# EAGLE design epoch-rev-a (EAGLE 9.7.0)
DOCUMENT_NUMBER: Epoch - 16-ch Vibe Controller; REV: A
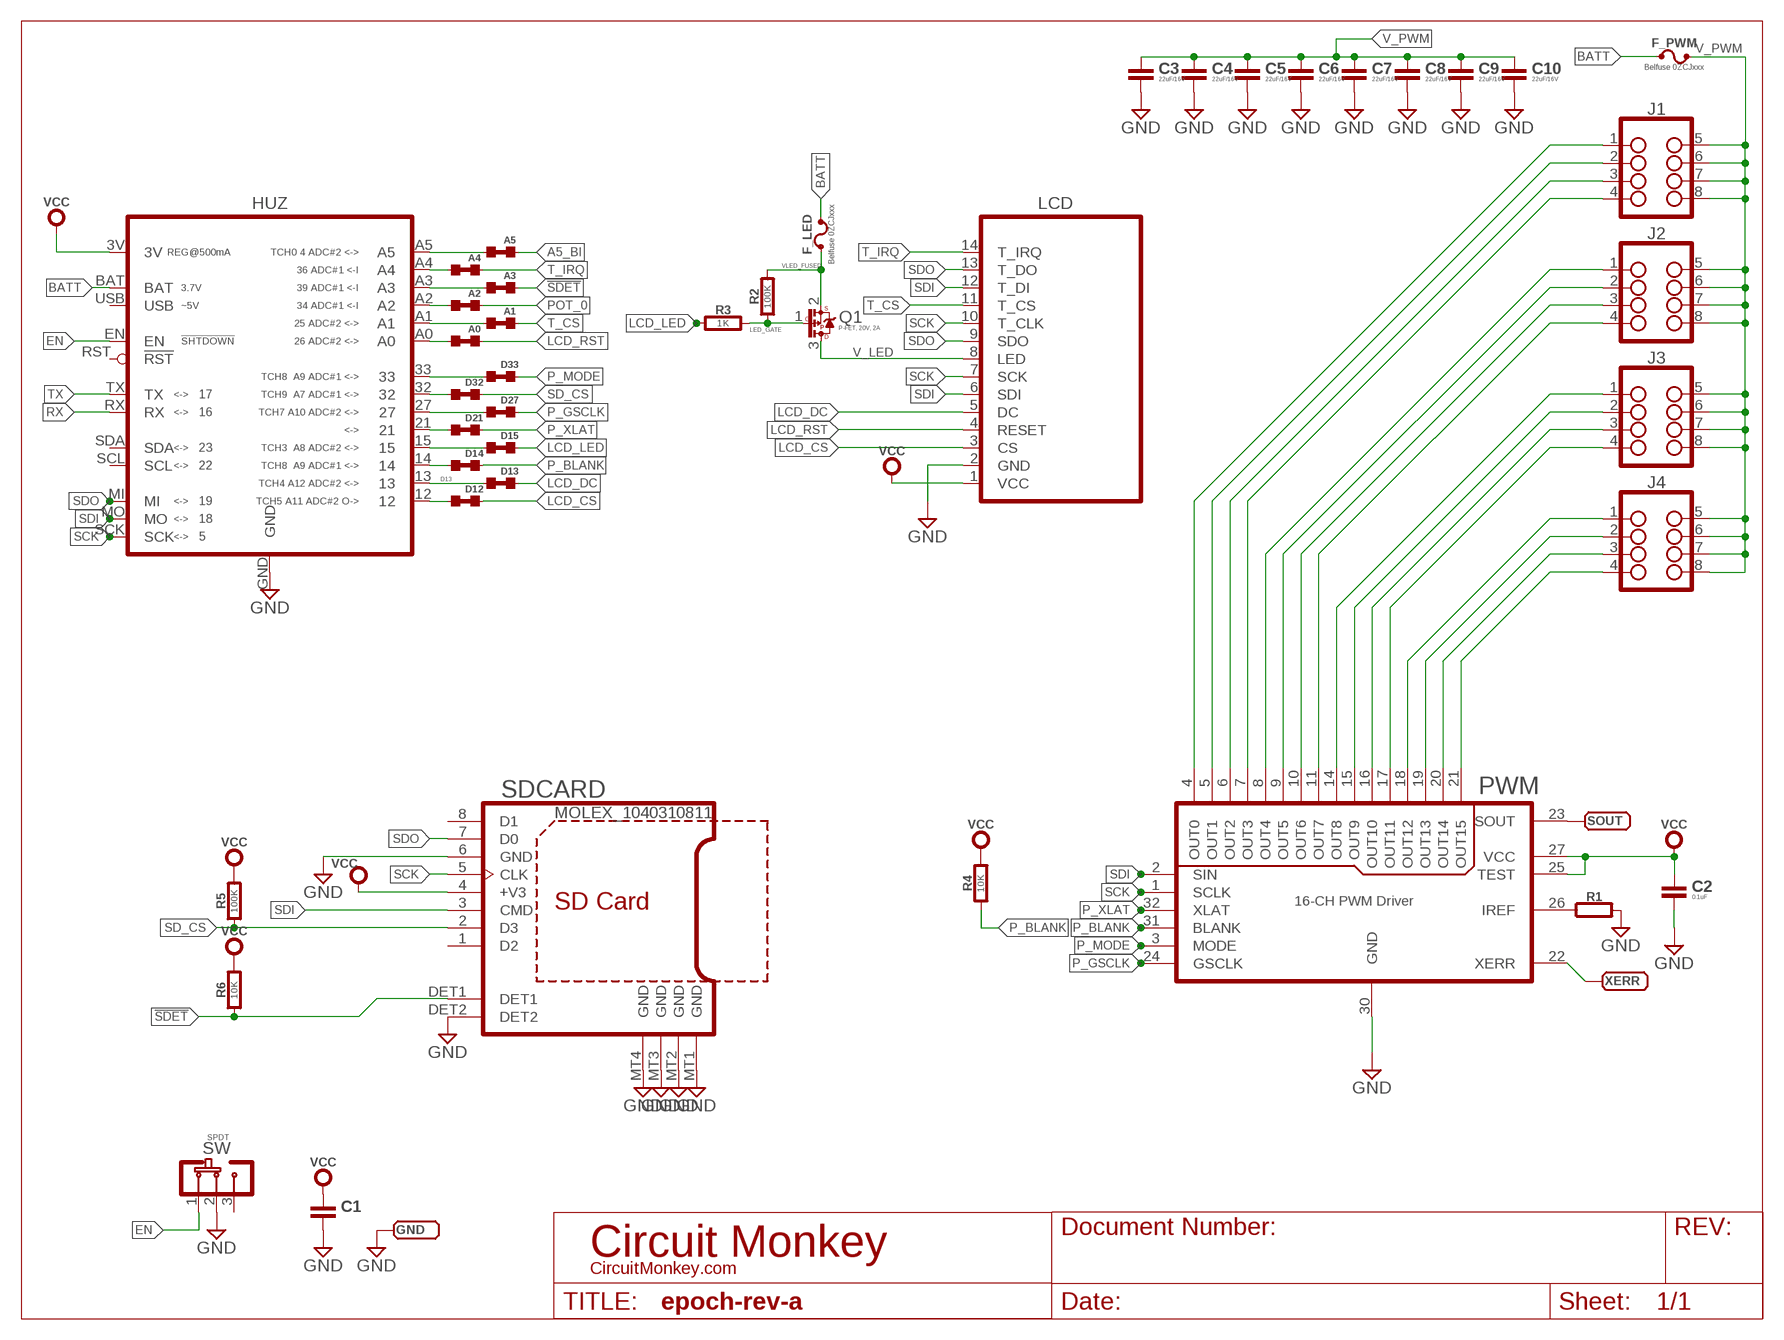
[diagram p0: schematic, sheet 1]

## Parts
A0  NP  SHORT0603  [0603-SHORT]
A1  NP  SHORT0603  [0603-SHORT]
A2  NP  SHORT0603  [0603-SHORT]
A3  NP  SHORT0603  [0603-SHORT]
A4  NP  SHORT0603  [0603-SHORT]
A5  NP  SHORT0603  [0603-SHORT]
C1  CAPACITOR0603  [0603-CAP]
C2  0.1uF  CAPACITOR0603  [0603-CAP]
C3  22uF/16V  CAPACITOR1210  [1210-CAP]
C4  22uF/16V  CAPACITOR1210  [1210-CAP]
C5  22uF/16V  CAPACITOR1210  [1210-CAP]
C6  22uF/16V  CAPACITOR1210  [1210-CAP]
C7  22uF/16V  CAPACITOR1210  [1210-CAP]
C8  22uF/16V  CAPACITOR1210  [1210-CAP]
C9  22uF/16V  CAPACITOR1210  [1210-CAP]
C10  22uF/16V  CAPACITOR1210  [1210-CAP]
D12  NP  SHORT0603  [0603-SHORT]
D13  NP  SHORT0603  [0603-SHORT]
D14  NP  SHORT0603  [0603-SHORT]
D15  NP  SHORT0603  [0603-SHORT]
D21  NP  SHORT0603  [0603-SHORT]
D27  NP  SHORT0603  [0603-SHORT]
D32  NP  SHORT0603  [0603-SHORT]
D33  NP  SHORT0603  [0603-SHORT]
F_LED  Belfuse 0ZCJxxx  FUSEPOLY-1206  [BELFUSE-1206]
F_PWM  Belfuse 0ZCJxxx  FUSEPOLY-1206  [BELFUSE-1206]
GND  PADSMD-050X050  [SMD-050X050]
HUZ  HUZZAHHUZZAH  [ADAFRUIT_HUZZAH32]
J1  NANOFIT-08P-DR-RA-THD  [MOLEX-105314-XX08]
J2  NANOFIT-08P-DR-RA-THD  [MOLEX-105314-XX08]
J3  NANOFIT-08P-DR-RA-THD  [MOLEX-105314-XX08]
J4  NANOFIT-08P-DR-RA-THD  [MOLEX-105314-XX08]
LCD  LCD-320X240-3.2-INCH-SPI-DIANN-LOWPROFILE  [LCD-320X240-DIANN-3.2-LP-SOCKET]
PWM  16-CH PWM Driver  TLC59401-QFN  [QFN-32]
Q1  P-FET, 20V, 2A  P-FETSOT-23-2A  [SOT-23]
R1  RESISTOR0603  [0603-RES]
R2  100K  RESISTOR0603  [0603-RES]
R3  1K  RESISTOR0603  [0603-RES]
R4  10K  RESISTOR0603  [0603-RES]
R5  100K  RESISTOR0603  [0603-RES]
R6  10K  RESISTOR0603  [0603-RES]
SDCARD  MOLEX_1040310811  MICRO-SD-CARDMOLEX-1040310811  [MOLEX_1040310811_USD]
SOUT  PADSMD-050X050  [SMD-050X050]
SW  SPDT  SLIDE-SPDTCK_TS01  [CK_TS01C]
XERR  PADSMD-050X050  [SMD-050X050]

## Nets
!SDET: A3.4 R6.1 SDCARD.DET1
A5_BI: A5.4
BATT: F_LED.2 F_PWM.1 HUZ.BAT
D12: D12.3 HUZ.12
D13: D13.3 HUZ.13
D14: D14.3 HUZ.14
D15: D15.3 HUZ.15
EN: HUZ.EN SW.1(A)
GND: C1.2 C2.2 C3.2 C4.2 C5.2 C6.2 C7.2 C8.2 C9.2 C10.2 GND.1(PAD) HUZ.GND LCD.2(GND) PWM.30(GND) R1.2 SDCARD.6(GND) SDCARD.DET2 SDCARD.MT1(GND) SDCARD.MT2(GND) SDCARD.MT3(GND) SDCARD.MT4(GND) SW.2(C)
LCD_CS: D12.4 LCD.3(CS)
LCD_DC: D13.4 LCD.5(DC)
LCD_LED: D15.4 R3.1
LCD_RST: A0.4 LCD.4(RESET)
LED_GATE: Q1.1(G) R2.1 R3.2
N$2: J4.4 PWM.21(OUT15)
N$3: J4.3 PWM.20(OUT14)
N$4: J4.2 PWM.19(OUT13)
N$5: J4.1 PWM.18(OUT12)
N$6: J3.4 PWM.17(OUT11)
N$7: J3.3 PWM.16(OUT10)
N$8: J3.2 PWM.15(OUT9)
N$9: J3.1 PWM.14(OUT8)
N$10: J2.4 PWM.11(OUT7)
N$11: J2.3 PWM.10(OUT6)
N$12: J2.2 PWM.9(OUT5)
N$13: J2.1 PWM.8(OUT4)
N$14: J1.4 PWM.7(OUT3)
N$15: J1.3 PWM.6(OUT2)
N$16: J1.2 PWM.5(OUT1)
N$17: J1.1 PWM.4(OUT0)
N$22: PWM.26(IREF) R1.1
N$23: PWM.22(XERR) XERR.1(PAD)
N$24: PWM.23(SOUT) SOUT.1(PAD)
N$27: D21.3 HUZ.21
N$28: D27.3 HUZ.27
N$29: D32.3 HUZ.32
N$30: D33.3 HUZ.33
N$31: A0.3 HUZ.A0
N$32: A1.3 HUZ.A1
N$33: A2.3 HUZ.A2
N$34: A3.3 HUZ.A3
N$35: A4.3 HUZ.A4
N$36: A5.3 HUZ.A5
P_BLANK: D14.4 PWM.31(BLANK) R4.1
P_GSCLK: D27.4 PWM.24(GSCLK)
P_MODE: D33.4 PWM.3(MODE)
P_XLAT: D21.4 PWM.32(XLAT)
POT_0: A2.4
RX: HUZ.RX
SCK: HUZ.SCK LCD.7(SCK) LCD.10(T_CLK) PWM.1(SCLK) SDCARD.5(CLK)
SD_CS: D32.4 R5.1 SDCARD.2(D3)
SDI: HUZ.MO LCD.6(SDI) LCD.12(T_DI) PWM.2(SIN) SDCARD.3(CMD)
SDO: HUZ.MI LCD.9(SDO) LCD.13(T_DO) SDCARD.7(D0)
T_CS: A1.4 LCD.11(T_CS)
T_IRQ: A4.4 LCD.14(T_IRQ)
TX: HUZ.TX
V_LED: LCD.8(LED) Q1.3(D)
V_PWM: C3.1 C4.1 C5.1 C6.1 C7.1 C8.1 C9.1 C10.1 F_PWM.2 J1.5 J1.6 J1.7 J1.8 J2.5 J2.6 J2.7 J2.8 J3.5 J3.6 J3.7 J3.8 J4.5 J4.6 J4.7 J4.8
VCC: C1.1 C2.1 HUZ.3V LCD.1(VCC) PWM.25(TEST) PWM.27(VCC) R4.2 R5.2 R6.2 SDCARD.4(+V3)
VLED_FUSED: F_LED.1 Q1.2(S) R2.2
Unconnected: HUZ.RST(!RST) HUZ.SCL HUZ.SDA HUZ.USB SDCARD.1(D2) SDCARD.8(D1) SW.3(B)

## Library data of the parts
A0 A1-A5 D12-D15 D21 D27 D32 D33 = rlc:SHORT: Pre-shorted SMT Resistor Pad
C1 C2 = rlc:CAPACITOR: Capacitor; COST01: 0.12; COST10: 0.09; COST100: 0.05
C3-C10 = rlc:CAPACITOR: Capacitor
F_LED F_PWM = fuse:FUSE: Fuse
GND SOUT XERR = con-testpoints:PAD: Solder Pad
HUZ = co-espressif:HUZZAH: AdaFruit Huzzah32
J1-J4 = con-molex:NANOFIT-08P-DR: 8-pin, Nanofit, 2-ROW, RA, SMD
LCD = display-lcd-oled:LCD-320X240-3.2-INCH-SPI
PWM = co-texas-instruments:TLC59401: 16-CHANNEL LED DRIVER WITH DOT CORRECTION AND GRAYSCALE PWM CONTROL; MFR: Texas Instruments; MOUSER: https://www.mouser.com/ProductDetail/Texas-Instruments/TLC59401RHBR?qs=sGAEpiMZZMtnFuLo2AlFPtoSfKJDVuimuLoLYJhTXxU%3D; MPN: TLC59401RHB
Q1 = transistor-fet:P-FET: P-FET (PFET); COST01: 0.45; COST10: 0.35; COST100: 0.25; MPN: FDN340P; SEEED: 305030026
R1-R6 = rlc:RESISTOR: Resistor; COST01: 0.10; COST10: 0.05; COST100: 0.02
SDCARD = con-memory-card:MICRO-SD-CARD: MICRO-SD; COST01: 2.25; COST10: 1.90; COST100: 1.60; MFR: Molex; MPN: 1040310811
SW = switch-thd:SLIDE-SPDT; COST01: 5.00; COST10: 4.00; COST100: 2.00; MFR: C&K; MPN: TS01C*

## Board
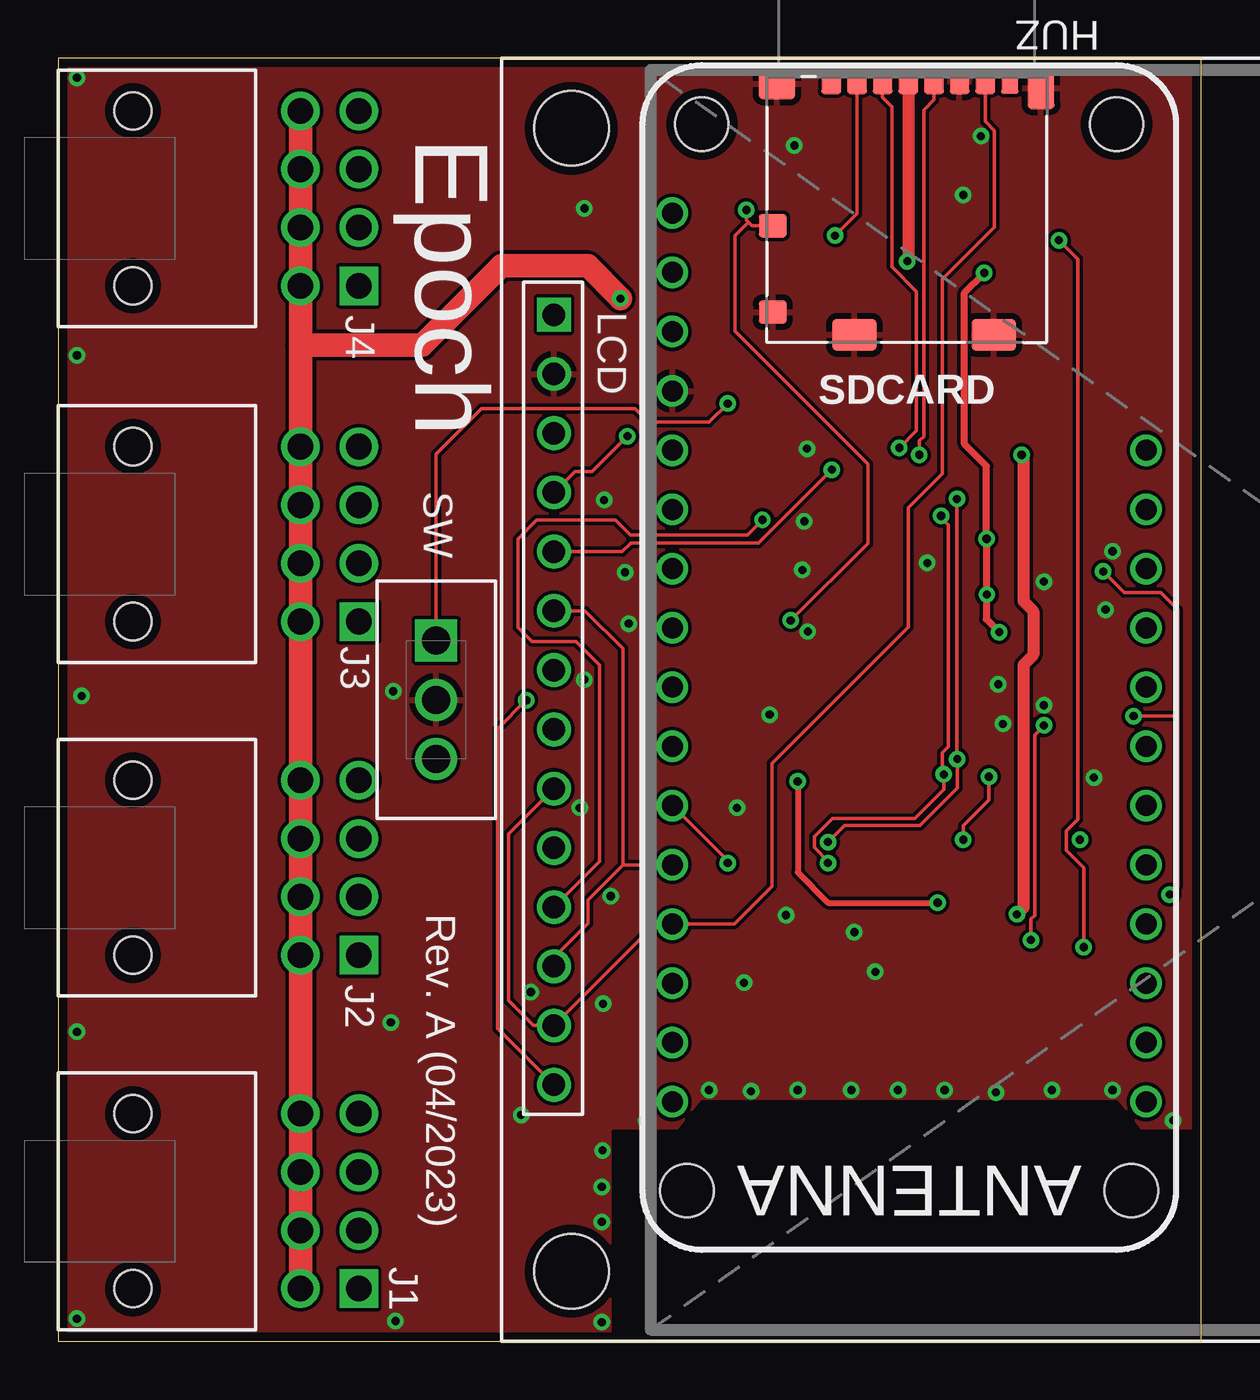
[diagram p1: board, top side]
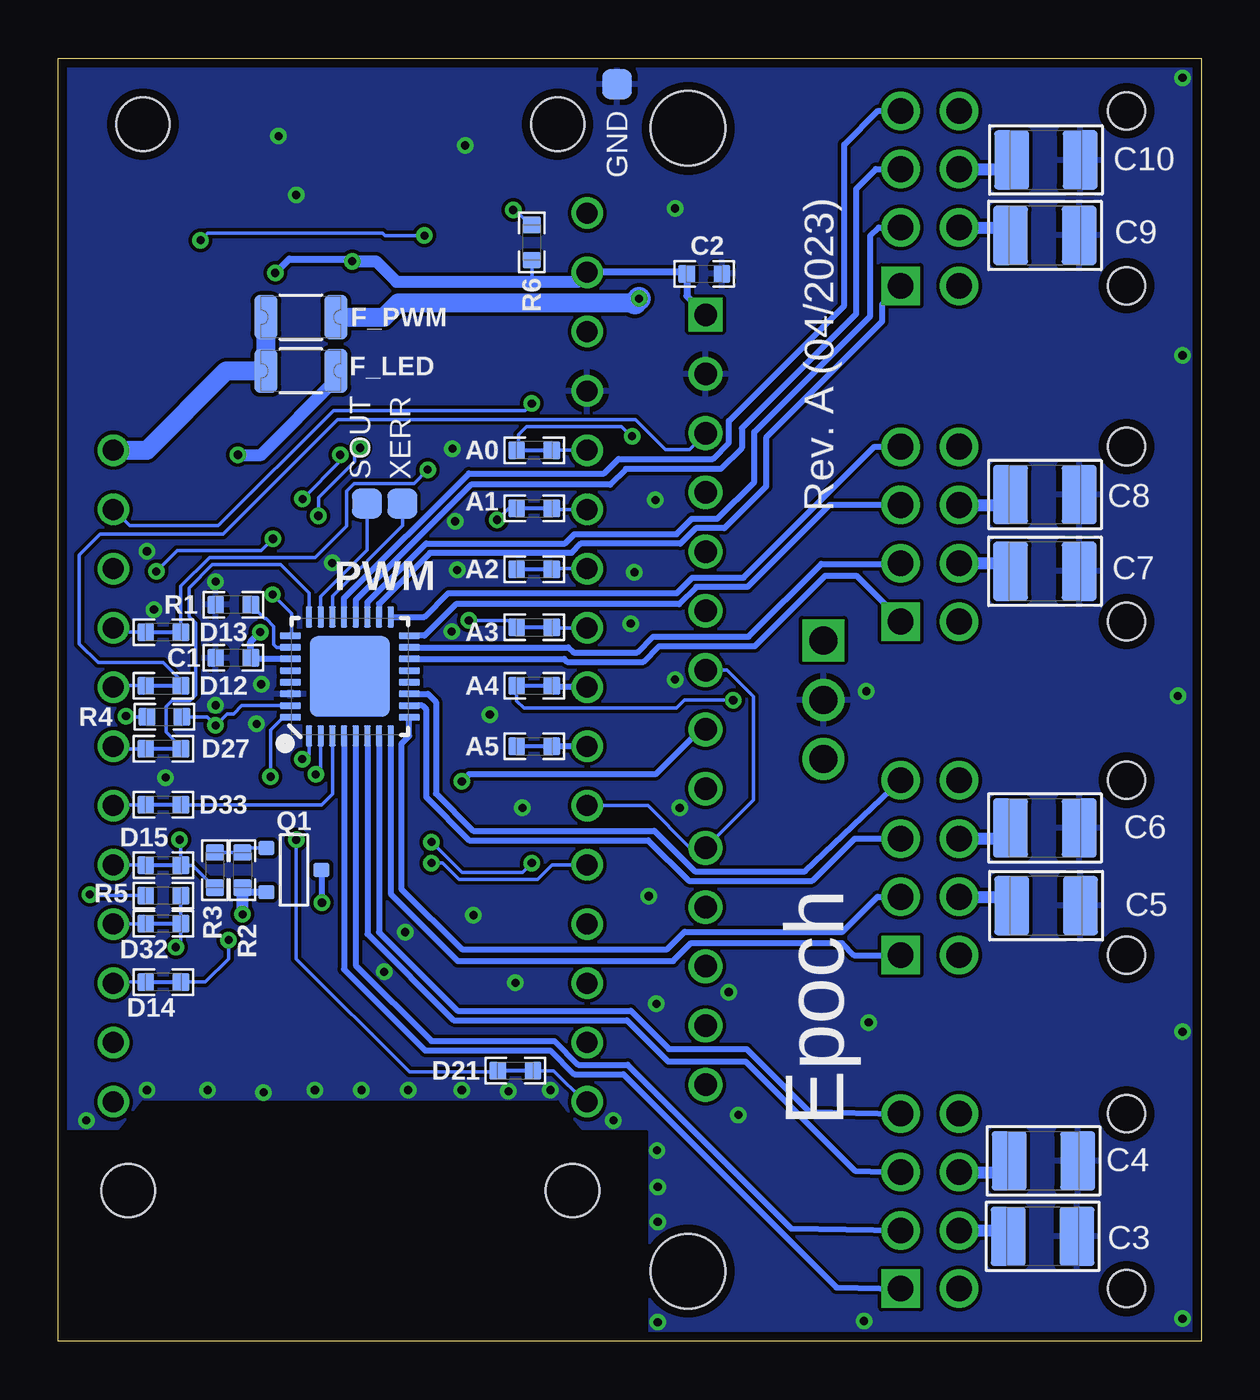
[diagram p2: board, bottom side, seen from below]

Size 49 x 55 mm. Coordinates in mm from the lower left corner, seen from the top.
Outline: 0,0 49,0 49,55 0,55 0,0
Copper layers (1*16): Top 0.0356mm / dielectric 1.5011mm / Bottom 0.0356mm
Design rules "OSH-CircuitMonkey *": minimum track width 6mil, minimum drill 12mil, track to track 6mil, track to pad 6mil, pad to pad 6mil, via to via 6mil, smd to smd 6mil, copper to edge 15mil, drill to drill 6mil, minimum pad ring 7mil, minimum via ring 7mil, stop-mask expansion 3mil, vias tented up to drill 14mil, thermal gap 10mil

### Footprints (pad centres in the part's own frame; a part is rotated, then mirrored left to right if it is on the bottom)
0603-SHORT = smd 0.711 x 0.762: 3 -0.752,0; 4 0.752,0
0603-CAP = smd 0.711 x 0.762: 1 -0.752,0; 2 0.752,0
1210-CAP = smd 1.5 x 2.54: 1 -1.472,0; 2 1.472,0
BELFUSE-1206 = smd 1 x 1.9: 1 -1.5,0; 2 1.5,0
SMD-050X050 = smd 1.27 x 1.27: 1 0.508,0
ADAFRUIT_HUZZAH32 = drill 0.9: 3V -16.51,-10.16; 12 1.27,10.16; 13 -1.27,10.16; 14 13.97,10.16; 15 8.89,10.16; 21 19.05,-10.16; 27 3.81,10.16; 32 11.43,10.16; 33 6.35,10.16; A0 -8.89,-10.16; A1 -6.35,-10.16; A2 -3.81,-10.16; A3 -1.27,-10.16; A4 1.27,-10.16; A5 3.81,-10.16; BAT -8.89,10.16; EN -6.35,10.16; GND -11.43,-10.16; MI 11.43,-10.16; MO 8.89,-10.16; NC -13.97,-10.16; RST -19.05,-10.16; RX 13.97,-10.16; SCK 6.35,-10.16; SCL 16.51,10.16; SDA 19.05,10.16; TX 16.51,-10.16; USB -3.81,10.16 | hole 2.286: -22.86,8.89; 22.86,9.525; 22.86,-9.525; -22.86,-8.89
MOLEX-105314-XX08 = drill 1.1 square: 1 12.88,-3.75 | drill 1.1: 2 12.88,-1.25; 3 12.88,1.25; 4 12.88,3.75; 5 10.38,-3.75; 6 10.38,-1.25; 7 10.38,1.25; 8 10.38,3.75 | hole 1.6: 3.2,3.75; 3.2,-3.75
LCD-320X240-DIANN-3.2-LP-SOCKET = drill 0.965 square: 1 -42.25,16.51 | drill 0.965: 2 -42.25,13.97; 3 -42.25,11.43; 4 -42.25,8.89; 5 -42.25,6.35; 6 -42.25,3.81; 7 -42.25,1.27; 8 -42.25,-1.27; 9 -42.25,-3.81; 10 -42.25,-6.35; 11 -42.25,-8.89; 12 -42.25,-11.43; 13 -42.25,-13.97; 14 -42.25,-16.51 | hole 3.2: -41.5,24.5; -41.5,-24.5
QFN-32 = smd 0.9 x 0.28: 1 -2.55,1.75; 2 -2.55,1.25; 3 -2.55,0.75; 4 -2.55,0.25; 5 -2.55,-0.25; 6 -2.55,-0.75; 7 -2.55,-1.25; 8 -2.55,-1.75; 17 2.55,-1.75; 18 2.55,-1.25; 19 2.55,-0.75; 20 2.55,-0.25; 21 2.55,0.25; 22 2.55,0.75; 23 2.55,1.25; 24 2.55,1.75 | smd 0.28 x 0.9: 9 -1.75,-2.55; 10 -1.25,-2.55; 11 -0.75,-2.55; 12 -0.25,-2.55; 13 0.25,-2.55; 14 0.75,-2.55; 15 1.25,-2.55; 16 1.75,-2.55; 25 1.75,2.55; 26 1.25,2.55; 27 0.75,2.55; 28 0.25,2.55; 29 -0.25,2.55; 30 -0.75,2.55; 31 -1.25,2.55; 32 -1.75,2.55 | smd 3.45 x 3.45: PAD 0,0
SOT-23 = smd 0.6 x 0.7: 1 -0.95,-1.18; 2 0.95,-1.18; 3 0,1.18
0603-RES = smd 0.711 x 0.762: 1 -0.752,0; 2 0.752,0
MOLEX_1040310811_USD = smd 0.85 x 1.1: 1 3.23,-5.503; 2 2.13,-5.503; 3 1.03,-5.503; 4 -0.07,-5.503; 5 -1.17,-5.503; 6 -2.27,-5.503; 7 -3.37,-5.503 | smd 0.75 x 1.1: 8 -4.42,-5.503 | smd 1.2 x 1: DET1 5.74,0.7; DET2 5.74,4.4 | smd 1.55 x 1.35: MT1 5.565,-5.4 | smd 1.17 x 1.8: MT2 -5.755,-5.2 | smd 1.9 x 1.35: MT3 -3.73,5.375; MT4 2.24,5.375
CK_TS01C = drill 1.2 square: 1 0,-2.54 | drill 1.2: 2 0,0; 3 0,2.54

### Placement (x,y rotation side)
A0  28.6,38.2 180 bottom
A1  28.6,35.7 180 bottom
A2  28.6,33.1 180 bottom
A3  28.6,30.6 180 bottom
A4  28.6,28.1 180 bottom
A5  28.6,25.5 180 bottom
C1  41.5,29.3 180 bottom
C2  21.3,45.76 0 bottom
C3  6.8,4.49 0 bottom
C4  6.76,7.73 0 bottom
C5  6.65,18.67 0 bottom
C6  6.7,22 0 bottom
C7  6.7,33.01 0 bottom
C8  6.7,36.3 0 bottom
C9  6.7,47.41 0 bottom
C10  6.66,50.64 0 bottom
D12  44.5,28.1 0 bottom
D13  44.5,30.4 0 bottom
D14  44.5,15.4 0 bottom
D15  44.5,20.4 0 bottom
D21  29.4,11.6 180 bottom
D27  44.5,25.4 0 bottom
D32  44.5,17.9 0 bottom
D33  44.5,23 0 bottom
F_LED  38.6,41.6 180 bottom
F_PWM  38.6,43.9 0 bottom
GND  25.05,54.4 270 bottom
HUZ  36.48,29.31 270 top
J1  0,6 0 top
J2  0,20.3 0 top
J3  0,34.6 0 top
J4  0,49 0 top
LCD  63.5,27.5 0 top
PWM  36.5,28.5 90 bottom
Q1  38.9,20.2 270 bottom
R1  41.5,31.58 180 bottom
R2  41.1,20.2 270 bottom
R3  42.28,20.2 90 bottom
R4  44.45,26.77 180 bottom
R5  44.5,19.1 180 bottom
R6  28.7,47.1 270 bottom
SDCARD  36.37,48.52 180 top
SOUT  35.77,35.4 90 bottom
SW  16.2,27.5 180 top
XERR  34.24,35.4 90 bottom

### Tracks (layer width: path | path; a pad name or v marks a point on that pad's centre or on a via)
!SDET  (via drill 0.35)
  Top 0.152: v31.4,30.9 34.7,34.2 34.7,37.6 29,43.3 29,47.39 29.58,47.97 | SDCARD.DET1 29.73,47.82 29.58,47.97 | 29.58,47.97 29.5,48.05 v29.5,48.5
  Bottom 0.152: A3.4 29.65,30.9 v31.4,30.9 | R6.1 28.75,47.85 29.4,48.5 v29.5,48.5
BATT
  Bottom 0.813: HUZ.BAT 45.2,38.2 41.8,41.6 F_LED.2 F_PWM.1
D12
  Bottom 0.152: HUZ.12 46.58,28.1 D12.3
D13
  Bottom 0.152: HUZ.13 46.46,30.4 D13.3
D14
  Bottom 0.152: D14.3 46.58,15.4 HUZ.14
D15
  Bottom 0.152: D15.3 45.27,20.42 HUZ.15
EN  (via drill 0.35)
  Top 0.152: v28.7,40.2 27.9,39.4 25.3,39.4 24.72,39.98 18.16,39.98 16.2,38.03 SW.1
  Bottom 0.152: HUZ.EN 45.94,34.96 42.14,34.96 37.2,39.9 29,39.9 v28.7,40.2
GND  (via drill 0.35)
  other vias: 40.3,28.16 40.5,26.46 30.5,26.86 31.9,33.06 32.1,38.26 31.2,18.26 29.4,15.36 45.2,33.86 24.3,32.96 23.4,36.06 1,27.66 0.8,13.26 0.8,42.26 0.8,0.96 0.8,54.16 25.2,9.46 47.8,9.46 45.2,10.76 42.6,10.76 40.2,10.66 38,10.76 36,10.76 34,10.76 31.7,10.76 27.9,10.76 29.7,10.71 23.3,6.61 23.3,5.11 23.3,0.81 23.68,19.08 39.56,51.66 31.56,51.26 22.56,48.56 14.36,27.86 14.26,13.66 14.46,0.86 22.56,28.36 24.46,30.76 22.36,22.86 23.36,14.46 20.26,14.96 29.1,22.86 44.9,31.36 44.4,24.16 31.98,35.15 32.14,30.42 38.8,49.14 42.26,32.56 42.26,27.26 23.33,8.18 19.84,9.7 34.13,17.54 35.03,15.84 37.26,33.36
  pour Top: 0.08,0.08 48.92,0.08 48.92,54.92 0.08,54.92
  pour Bottom: 0.08,0.08 48.92,0.08 48.92,54.92 0.08,54.92
LCD_CS
  Bottom 0.152: LCD.3 21.95,38.23 22.97,38.23 24.25,39.51 37.02,39.51 41.93,34.6 47.2,34.6 48.1,33.7 48.1,29.9 47.3,29.1 44.5,29.1 43.75,28.35 D12.4
LCD_DC  (via drill 0.35)
  Top 0.152: v33.16,37.36 30.03,34.23 24.55,34.23 24.17,33.85 LCD.5
  Bottom 0.152: D13.4 43.75,32.37 42.52,33.59 37.98,33.59 36.63,34.95 36.63,36.45 36.31,36.77 33.75,36.77 v33.16,37.36
LCD_LED  (via drill 0.35)
  Bottom 0.152: v43.8,21.5 43.75,21.45 D15.4 43.25,20.4 42.3,19.45 R3.1
LCD_RST  (via drill 0.35)
  Top 0.152: v24.4,38.8 22.89,37.29 22.15,37.29 LCD.4
  Bottom 0.152: A0.4 29.26,38.29 29.26,38.87 28.93,39.21 24.85,39.21 24.64,39 24.6,39 v24.4,38.8
LED_GATE
  Bottom 0.152: R3.2 R2.1 40.9,21.15 Q1.1
N$2
  Bottom 0.254: PWM.21 36.75,31.85 31.4,37.2 25.6,37.2 24.97,37.83 20.93,37.83 20.25,38.51 20.25,39.45 15.3,44.4 15.3,51.3 13.85,52.75 J4.4
N$3
  Bottom 0.254: J4.3 13.95,50.25 14.79,49.41 14.79,44.05 19.7,39.14 19.7,38.3 20.61,37.39 24.67,37.39 25.34,36.72 31.31,36.72 36.25,31.77 PWM.20
N$4
  Bottom 0.254: PWM.19 35.75,31.68 33.23,34.21 27.27,34.21 26.88,34.6 22.49,34.6 21.83,35.26 20.74,35.26 19.16,36.84 19.16,38.98 14.19,43.95 14.19,47.39 13.82,47.75 J4.2
N$5
  Bottom 0.254: J4.1 13.68,44.45 13.68,43.71 18.65,38.74 18.65,36.65 20.45,34.85 21.67,34.85 22.32,34.19 26.6,34.19 26.99,33.8 33.06,33.8 35.25,31.61 PWM.18
N$6
  Bottom 0.254: PWM.17 33.3,31.05 32.28,32.07 22.48,32.07 21.82,32.74 19.62,32.74 14.01,38.35 J3.4
N$7
  Bottom 0.254: PWM.16 33.31,30.25 31.96,31.6 22.38,31.6 21.65,32.33 19.45,32.33 15.94,35.85 J3.3
N$8
  Bottom 0.254: PWM.15 27.14,29.75 26.92,29.53 24.17,29.53 23.49,30.21 19.4,30.21 16.28,33.33 12.88,33.33 J3.2
N$9
  Bottom 0.254: PWM.14 27.31,29.25 27.18,29.12 23.92,29.12 23.24,29.8 19.14,29.8 16.12,32.82 14.78,32.82 12.88,30.91 J3.1
N$10
  Bottom 0.254: J2.4 16.98,20.15 21.71,20.15 23.45,21.88 31.22,21.88 32.81,23.48 32.81,27.41 33.15,27.75 PWM.11
N$11
  Bottom 0.254: J2.3 14.86,21.55 16.67,19.74 21.97,19.74 23.71,21.48 31.39,21.48 33.22,23.31 33.22,27.08 33.39,27.25 PWM.10
N$12
  Bottom 0.254: PWM.9 33.95,25.95 34.3,25.6 34.3,19.4 31.7,16.8 22.9,16.8 22.15,17.55 15.38,17.55 13.88,19.05 J2.2
N$13
  Bottom 0.254: PWM.8 34.75,19.18 31.87,16.3 22.64,16.3 21.87,17.07 15.4,17.07 14.88,16.55 J2.1
N$14
  Bottom 0.254: J1.4 16.79,9.82 19.49,12.53 22.82,12.53 24.46,14.16 31.88,14.16 35.25,17.53 PWM.7
N$15
  Bottom 0.254: J1.3 14.85,7.31 19.53,11.99 22.86,11.99 24.62,13.76 32.05,13.76 35.75,17.46 PWM.6
N$16
  Bottom 0.254: PWM.5 36.25,16.12 33,12.87 27.74,12.87 26.72,11.85 24.6,11.85 17.59,4.84 J1.2
N$17
  Bottom 0.254: J1.1 15.65,2.31 24.78,11.44 26.89,11.44 27.9,12.46 33.27,12.46 36.75,15.94 PWM.4
N$22
  Bottom 0.152: PWM.26 39.64,29.75 39.76,29.87 39.76,30.64 40.1,30.98 40.15,30.98 R1.1
N$23
  Bottom 0.152: PWM.22 37.25,31.95 34.24,34.96 XERR.1
N$24
  Bottom 0.152: SOUT.1 35.77,33.92 37.75,31.93 PWM.23
N$27
  Bottom 0.152: HUZ.21 26.42,10.26 27.76,11.6 D21.3
N$28
  Bottom 0.152: D27.3 46.54,25.4 HUZ.27
N$29
  Bottom 0.152: D32.3 46.62,17.9 HUZ.32
N$30
  Bottom 0.152: D33.3 46.6,23 HUZ.33
N$31
  Bottom 0.152: HUZ.A0 A0.3
N$32
  Bottom 0.152: HUZ.A1 27.81,35.66 A1.3
N$33
  Bottom 0.152: HUZ.A2 27.83,33.12 A2.3
N$34
  Bottom 0.152: HUZ.A3 27.83,30.58 A3.3
N$35
  Bottom 0.254: HUZ.A4 27.79,28.04 A4.3
N$36
  Bottom 0.254: HUZ.A5 A5.3
P_BLANK  (via drill 0.35)
  Top 0.152: v41.7,17.2 41.7,18.1 41.86,18.26 41.86,26 v42.26,26.4
  Bottom 0.152: PWM.31 41.14,27.25 41.49,26.9 41.76,26.9 v42.26,26.4 42.63,26.77 R4.1 | v41.7,17.2 41.7,16.4 42.7,15.4 D14.4
P_GSCLK
  Bottom 0.152: PWM.24 38.25,32.07 39.47,33.29 42.39,33.29 43.4,32.28 43.4,31.07 43.12,30.79 43.12,27.71 43.35,27.48 44.11,27.48 44.38,27.2 44.38,26.12 43.84,25.57 43.84,25.49 D27.4
P_MODE
  Bottom 0.152: D33.4 37.7,23 37.25,23.45 PWM.3
P_XLAT  (via drill 0.35)
  Top 0.152: v39.9,24.2 39.9,23.2 38.8,22.1 v38.8,21.5
  Bottom 0.152: v38.8,21.5 38.8,16.4 33.94,11.54 30.21,11.54 D21.4 | PWM.32 39.35,26.75 39.9,26.2 v39.9,24.2
SCK  (via drill 0.35)
  Top 0.152: v28.7,20.5 28.7,20.58 HUZ.SCK | v33,21.4 33.7,22.1 36.93,22.1 38.54,23.71 38.54,24.94 38.53,24.96 | SDCARD.5 37.54,53.22 37.1,52.78 37.1,38.79 36.91,38.6 v36.91,38 | 38.53,24.96 38.52,24.96 38.52,36.1 v38.53,36.11 | 38.53,24.96 v38.54,24.96
  Bottom 0.152: HUZ.SCK 23.72,22.96 21.91,21.15 LCD.10 19.2,23.2 19.2,27.64 20.33,28.77 LCD.7 | v28.7,20.5 29.1,20.1 31.7,20.1 v33,21.4 | v38.53,36.11 36.91,37.72 v36.91,38 | v38.54,24.96 38.44,24.96 38.25,25.15 PWM.1
SD_CS  (via drill 0.35)
  Top 0.152: v43.96,16.9 43.96,20.3 43.22,21.04 43.22,21.88 43.7,22.36 43.7,46.4 v42.9,47.2 | SDCARD.2 34.24,48.34 v33.3,47.4
  Bottom 0.152: v43.96,16.9 43.75,17.11 D32.4 R5.1 | v33.3,47.4 35,47.4 35.1,47.5 42.6,47.5 v42.9,47.2
SDI  (via drill 0.35)
  Top 0.152: LCD.6 22.59,31.31 24.2,29.7 24.2,20.42 HUZ.MO 24.2,20.42 22.7,18.92 22.7,17.91 21.25,16.46 LCD.12 | SDCARD.3 35.34,53.32 35.74,52.92 35.74,46.06 36.8,45 36.8,39.04 v36.06,38.3 | v37.85,35.39 37.81,35.35 38.16,35 38.16,25.5 37.9,25.24 37.9,24.3 v37.96,24.3 37.96,23.65 36.72,22.41 33.18,22.41 32.42,21.64 32.42,21.16 33,20.58 v33,20.5
  Bottom 0.152: PWM.2 37.75,24.51 v37.96,24.3 | v36.06,38.3 36.3,38.06 36.3,37.71 37.85,36.16 v37.85,35.39 | HUZ.MO 27.82,20.42 28.45,19.8 31.83,19.8 32.53,20.5 v33,20.5
SDO
  Top 0.152: LCD.9 19.3,21.74 19.3,14.6 20.37,13.53 LCD.13 25.6,17.88 HUZ.MI 28.98,17.88 30.6,19.5 30.6,24.78 36.44,30.62 36.44,35.74 37.9,37.19 37.9,45.53 40.14,47.77 40.14,51.9 39.74,52.3 SDCARD.7
T_CS  (via drill 0.35)
  Top 0.152: LCD.11 23.2,20.56 23.2,29 22.2,30 20.3,30 19.7,30.6 19.7,34.4 20.5,35.2 23.9,35.2 24.54,34.56 29.54,34.56 v30.19,35.21
  Bottom 0.152: A1.4 29.7,35.7 v30.19,35.21
T_IRQ  (via drill 0.35)
  Top 0.152: v20.06,27.48 18.84,26.25 18.84,13.4 LCD.14
  Bottom 0.152: A4.4 29.35,27.45 29.04,27.14 22.49,27.14 22.14,27.48 v20.06,27.48
V_LED  (via drill 0.35)
  Top 0.254: v31.7,24 31.7,20.1 33,18.8 v37.7,18.8
  Bottom 0.254: LCD.8 21.47,26.23 23.4,24.3 31.4,24.3 v31.7,24 | Q1.3 37.7,20.18 v37.7,18.8
V_PWM  (via drill 0.35)
  Top 1.016: v24.1,44.7 22.7,46.1 19,46.1 15.6,42.7 10.38,42.7 | J4.8 J4.7 J4.6 J4.5 10.38,42.7 | 10.38,42.7 J3.8 J3.7 J3.6 J3.5 J2.8 J2.7 J2.6 J2.5 J1.8 J1.7 J1.6 J1.5
  Bottom 0.508: J4.7 8.52,50.25 C10.1 | J4.6 8.51,47.75 C9.1 | J3.7 8.62,35.85 C8.1 | J3.6 8.61,33.35 8.53,33.37 C7.1 | J2.7 8.62,21.55 C6.1 | J2.6 8.5,19.05 C5.1 | J1.7 8.71,7.25 C4.1 | J1.6 8.27,4.75 C3.1
  Bottom 0.813: F_PWM.2 35.03,43.9 34.42,44.52 24.28,44.52
  Bottom 1.016: 24.28,44.52 v24.1,44.7
VCC  (via drill 0.35)
  Top 0.152: v47.65,19.15 48,19.5 48,26.8 | v46.1,26.8 48,26.8 | 48,26.8 48,31.36 47.28,32.09 45.71,32.09 v44.8,33
  Top 0.305: v40.34,30.4 39.78,30.96 39.78,31.98 v39.81,32.01 39.8,32.02 v39.8,34.4 39.8,37.51 38.85,38.46 38.85,44.95 v39.7,45.8
  Top 0.508: SDCARD.4 36.44,46.34 v36.4,46.3
  Bottom 0.152: PWM.25 39,30.3 39,31.2 v39.81,32.01 | v46.1,26.8 46.07,26.77 R4.2 | v44.8,33 43.9,33.9 40.3,33.9 v39.8,34.4 | R6.2 28.7,45.42 | R5.2 47.6,19.1 v47.65,19.15
  Bottom 0.254: PWM.27 40.7,29.25 C1.1
  Bottom 0.305: HUZ.3V 22.11,45.82 C2.1 22.05,44.81 LCD.1 | C1.1 40.75,29.99 v40.34,30.4 | v39.7,45.8 39.1,46.4 36.5,46.4 v36.4,46.3
  Bottom 0.508: HUZ.3V 26.72,45.42 28.7,45.42 34.5,45.42 35.38,46.3 v36.4,46.3
VLED_FUSED  (via drill 0.35)
  Top 0.508: v41.1,18.3 41.38,18.58 41.38,29 41.8,29.42 41.8,31.3 41.38,31.72 41.38,37.92 v41.3,38
  Bottom 0.305: Q1.2 40.9,19.25 R2.2
  Bottom 0.508: F_LED.1 37.1,41.2 40.3,38 v41.3,38 | v41.1,18.3 R2.2

### Text on the board
tPlace: Epoch | Rev. A (04/2023)
bPlace: Rev. A (04/2023) | Epoch